# EAGLE schematic P1DuRFIDBreakout (EAGLE 8.7.0)
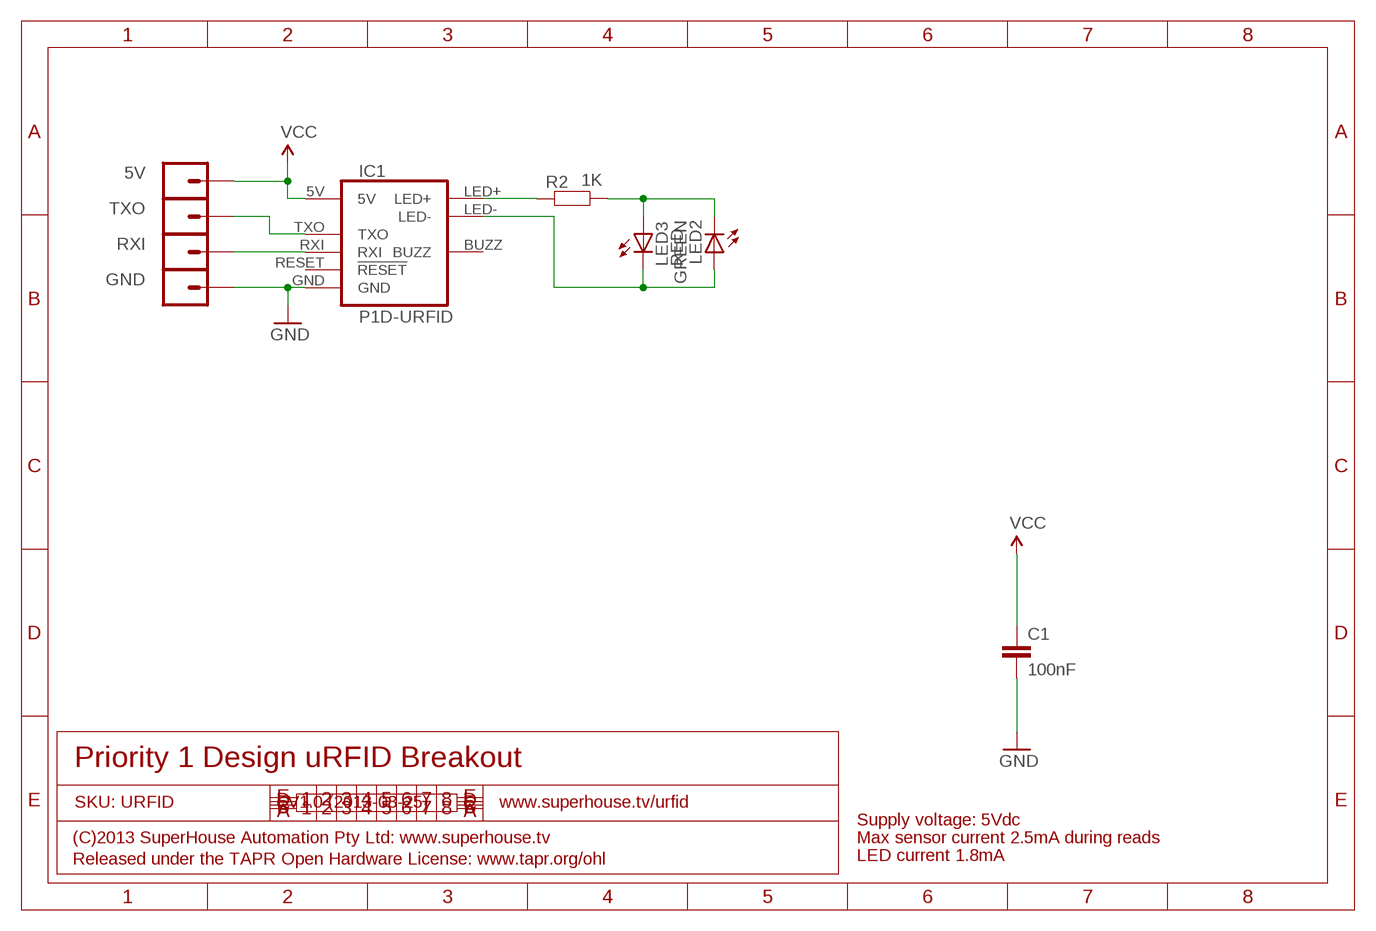
[diagram p0: schematic, sheet 1]

## Parts
5V  M01PTH  [1X01]
C1  100nF  CAP0603  [0603]
GND  M01PTH  [1X01]
IC1  P1D-URFID  [URFID]
LED2  GREEN  LED3MM  [LED3MM]
LED3  RED  LED3MM  [LED3MM]
R2  1K  RESISTOR0603  [0603]
RXI  M01PTH  [1X01]
TXO  M01PTH  [1X01]

## Nets
GND: C1.2 GND.1 IC1.GND
N$2: IC1.LED+ R2.2
N$3: LED2.K(C) LED3.A R2.1
N$4: IC1.LED- LED2.A LED3.K(C)
N$5: IC1.RXI RXI.1
N$6: IC1.TXO TXO.1
VCC: 5V.1 C1.1 IC1.5V
Unconnected: IC1.BUZZ IC1.RESET(!RESET)

## Notes on the sheet
- Priority 1 Design uRFID Breakout
- SKU: URFID | V1.0 (2013-03-25) | www.superhouse.tv/urfid
- Supply voltage: 5Vdc
- (C)2013 SuperHouse Automation Pty Ltd: www.superhouse.tv | Max sensor current 2.5mA during reads
- Released under the TAPR Open Hardware License: www.tapr.org/ohl | LED current 1.8mA

## Library data of the parts
5V GND RXI TXO = freetronics-master-v1:M01: Header 1 Standard 1-pin 0.1" header. Use with straight break away headers (SKU : PRT-00116), right angle break away headers (PRT-00553), swiss pins (PRT-00743), machine pins (PRT-00117), and female headers (PRT-00115).
C1 = freetronics-master-v1.1:CAP: Capacitor Standard 0603 ceramic capacitor, and 0.1" leaded capacitor.
IC1 = freetronics-jon:P1D-URFID
LED2 LED3 = freetronics-jon:LED: LEDs Standard schematic elements and footprints for 5mm, 3mm, 1206, and 0603 sized LEDs. 5mm - Spark Fun Electronics SKU : COM-00529 (and others)
R2 = freetronics-master-v1:RESISTOR: Resistor Basic schematic elements and footprints for 0603, 1206, and PTH 1/10th watt (small) resistors.